# EAGLE design Keypad Arduino Uno Shield (EAGLE 9.6.2)
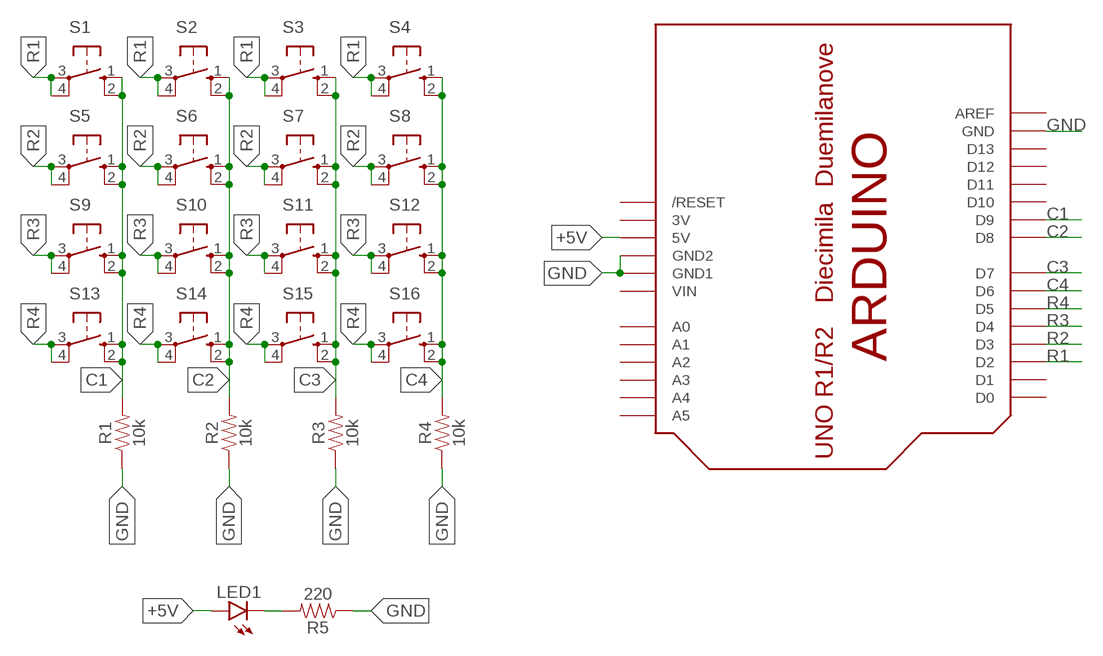
[diagram p0: schematic, sheet 1]

## Parts
LED1  LEDSML0805  [SML0805]
R1  10k  RESISTOR1206  [1206]
R2  10k  RESISTOR1206  [1206]
R3  10k  RESISTOR1206  [1206]
R4  10k  RESISTOR1206  [1206]
R5  220  RESISTOR1206  [1206]
S1  10-XX  [B3F-10XX]
S2  10-XX  [B3F-10XX]
S3  10-XX  [B3F-10XX]
S4  10-XX  [B3F-10XX]
S5  10-XX  [B3F-10XX]
S6  10-XX  [B3F-10XX]
S7  10-XX  [B3F-10XX]
S8  10-XX  [B3F-10XX]
S9  10-XX  [B3F-10XX]
S10  10-XX  [B3F-10XX]
S11  10-XX  [B3F-10XX]
S12  10-XX  [B3F-10XX]
S13  10-XX  [B3F-10XX]
S14  10-XX  [B3F-10XX]
S15  10-XX  [B3F-10XX]
S16  10-XX  [B3F-10XX]
U$1  ARDUINOUNO  [ARDUINO]

## Nets
+5V: LED1.A U$1.5V
C1: R1.2 S1.1(S) S1.2(S1) S5.1(S) S5.2(S1) S9.1(S) S9.2(S1) S13.1(S) S13.2(S1) U$1.D9
C2: R2.2 S2.1(S) S2.2(S1) S6.1(S) S6.2(S1) S10.1(S) S10.2(S1) S14.1(S) S14.2(S1) U$1.D8
C3: R3.2 S3.1(S) S3.2(S1) S7.1(S) S7.2(S1) S11.1(S) S11.2(S1) S15.1(S) S15.2(S1) U$1.D7
C4: R4.2 S4.1(S) S4.2(S1) S8.1(S) S8.2(S1) S12.1(S) S12.2(S1) S16.1(S) S16.2(S1) U$1.D6
GND: R1.1 R2.1 R3.1 R4.1 R5.1 U$1.GND U$1.GND1 U$1.GND2
N$10: LED1.C R5.2
R1: S1.3(P) S1.4(P1) S2.3(P) S2.4(P1) S3.3(P) S3.4(P1) S4.3(P) S4.4(P1) U$1.D2
R2: S5.3(P) S5.4(P1) S6.3(P) S6.4(P1) S7.3(P) S7.4(P1) S8.3(P) S8.4(P1) U$1.D3
R3: S9.3(P) S9.4(P1) S10.3(P) S10.4(P1) S11.3(P) S11.4(P1) S12.3(P) S12.4(P1) U$1.D4
R4: S13.3(P) S13.4(P1) S14.3(P) S14.4(P1) S15.3(P) S15.4(P1) S16.3(P) S16.4(P1) U$1.D5
Unconnected: U$1.A0 U$1.A1 U$1.A2 U$1.A3 U$1.A4 U$1.A5 U$1.AREF U$1.D0 U$1.D1 U$1.D10 U$1.D11 U$1.D12 U$1.D13 U$1.RESET(/RESET)

## Power pins joined to a net without a drawn wire
3V: U$1.3V
VIN: U$1.VIN

## Library data of the parts
LED1 = led:LED: LED OSRAM: - CHIPLED LG R971, LG N971, LY N971, LG Q971, LY Q971, LO R971, LY R971 LH N974, LH R974 LS Q976, LO Q976, LY Q976 LO Q996 - Hyper CHIPLED LW Q18S LB Q993, LB Q99A, LB R99A - SideLED LS A670, LO A670, LY A670, LG A670, LP A670 LB A673, LV A673, LT A673, LW A673 LH A674 LY A675 LS A676, LA A676, LO A676, LY A676, LW A676 LS A679, LY A679, LG A679 - Hyper Micro SIDELED® LS Y876, LA Y876, LO Y876, LY Y876 LT Y87S - SmartLED LW L88C, LW L88S LB L89C, LB L89S, LG L890 LS L89K, LO L89K, LY L89K LS L896, LA L896, LO L896, LY L896 - TOPLED LS T670, LO T670, LY T670, LG T670, LP T670 LSG T670, LSP T670, LSY T670, LOP T670, LYG T670 LG T671, LOG T671, LSG T671 LB T673, LV T673, LT T673, LW T673 LH T674 LS T676, LA T676, LO T676, LY T676, LB T676, LH T676, LSB T676, LW T676 LB T67C, LV T67C, LT T67C, LS T67K, LO T67K, LY T67K, LW E67C LS E67B, LA E67B, LO E67B, LY E67B, LB E67C, LV E67C, LT E67C LW T67C LS T679, LY T679, LG T679 LS T770, LO T770, LY T770, LG T770, LP T770 LB T773, LV T773, LT T773, LW T773 LH T774 LS E675, LA E675, LY E675, LS T675 LS T776, LA T776, LO T776, LY T776, LB T776 LHGB T686 LT T68C, LB T68C - Hyper Mini TOPLED® LB M676 - Mini TOPLED Santana® LG M470 LS M47K, LO M47K, LY M47K Source: http://www.osram.convergy.de LUXEON: - LUMILED® LXK2-PW12-R00, LXK2-PW12-S00, LXK2-PW14-U00, LXK2-PW14-V00 LXK2-PM12-R00, LXK2-PM12-S00, LXK2-PM14-U00 LXK2-PE12-Q00, LXK2-PE12-R00, LXK2-PE12-S00, LXK2-PE14-T00, LXK2-PE14-U00 LXK2-PB12-K00, LXK2-PB12-L00, LXK2-PB12-M00, LXK2-PB14-N00, LXK2-PB14-P00, LXK2-PB14-Q00 LXK2-PR12-L00, LXK2-PR12-M00, LXK2-PR14-Q00, LXK2-PR14-R00 LXK2-PD12-Q00, LXK2-PD12-R00, LXK2-PD12-S00 LXK2-PH12-R00, LXK2-PH12-S00 LXK2-PL12-P00, LXK2-PL12-Q00, LXK2-PL12-R00 Source: www.luxeon.com KINGBRIGHT: KA-3528ASYC Source: www.kingbright.com
R1-R5 = SparkFun-Resistors:RESISTOR: Generic Resistor Package
S1-S16 = switch-omron:10-XX: OMRON SWITCH; MPN: B3F-1000; OC_FARNELL: 176432; OC_NEWARK: 36M3542
U$1 = adafruit:ARDUINO: Arduino Diecimila/Duemilanove Make a shield with ease, this package has all the named pins as well as the two mounting drill holes and an outline of the USB and DC power connector. The outline is on the DIMENSION layer, so if your board house uses it they will cut the outline to match. http://www.ladyada.net/library/pcb/eaglelibrary.html

## Board
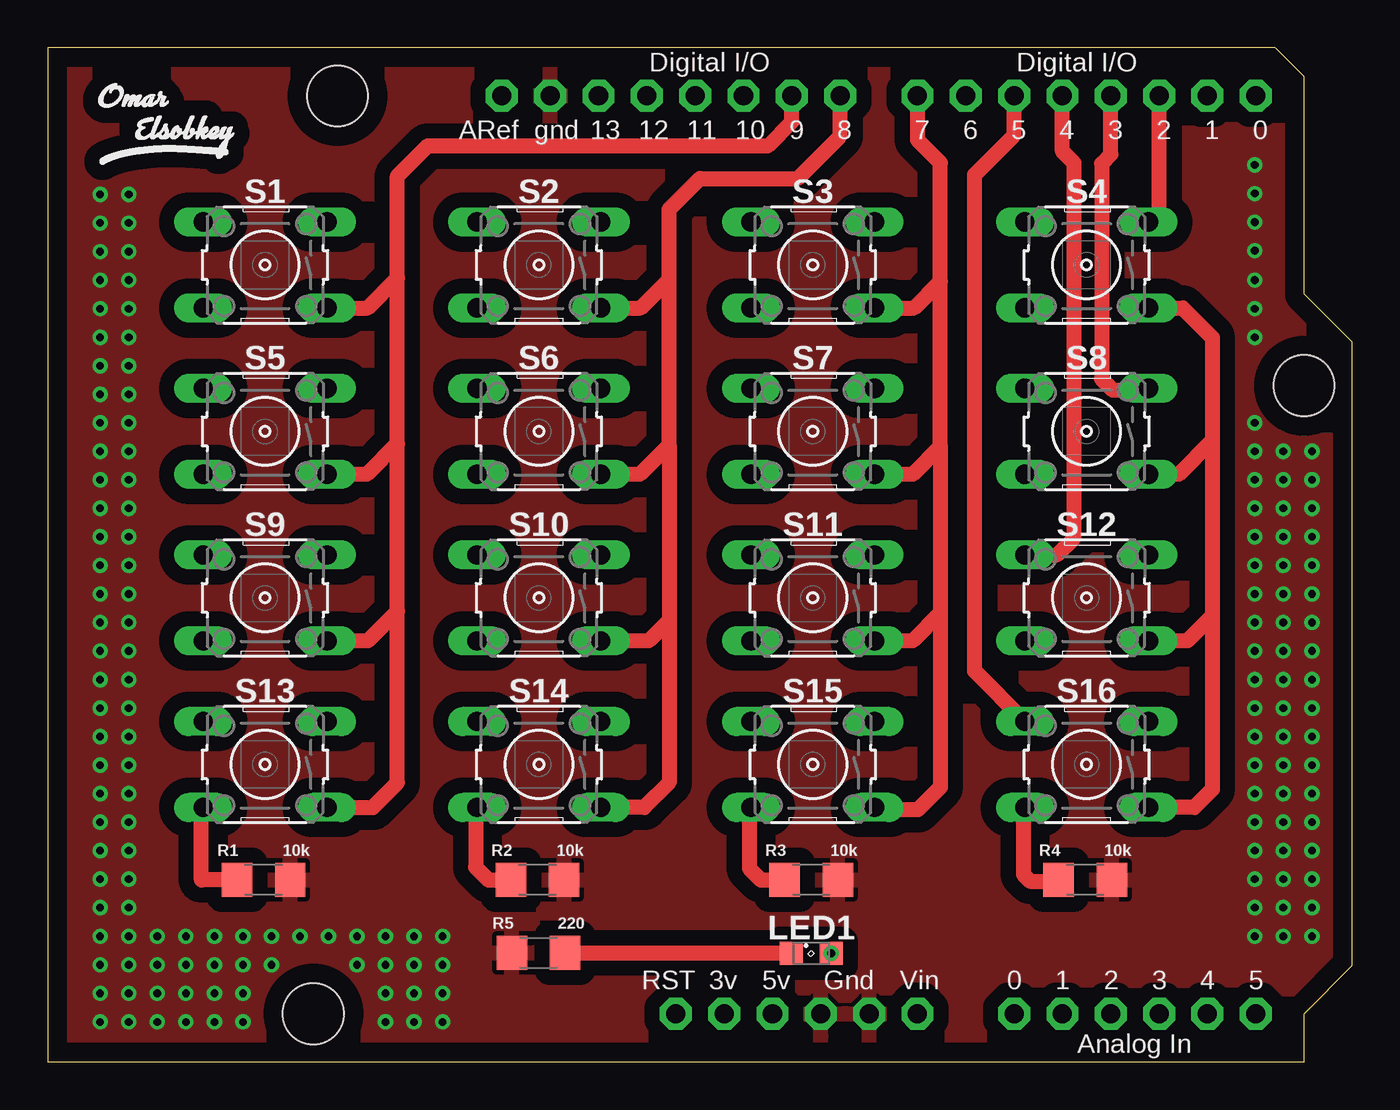
[diagram p1: board, top side]
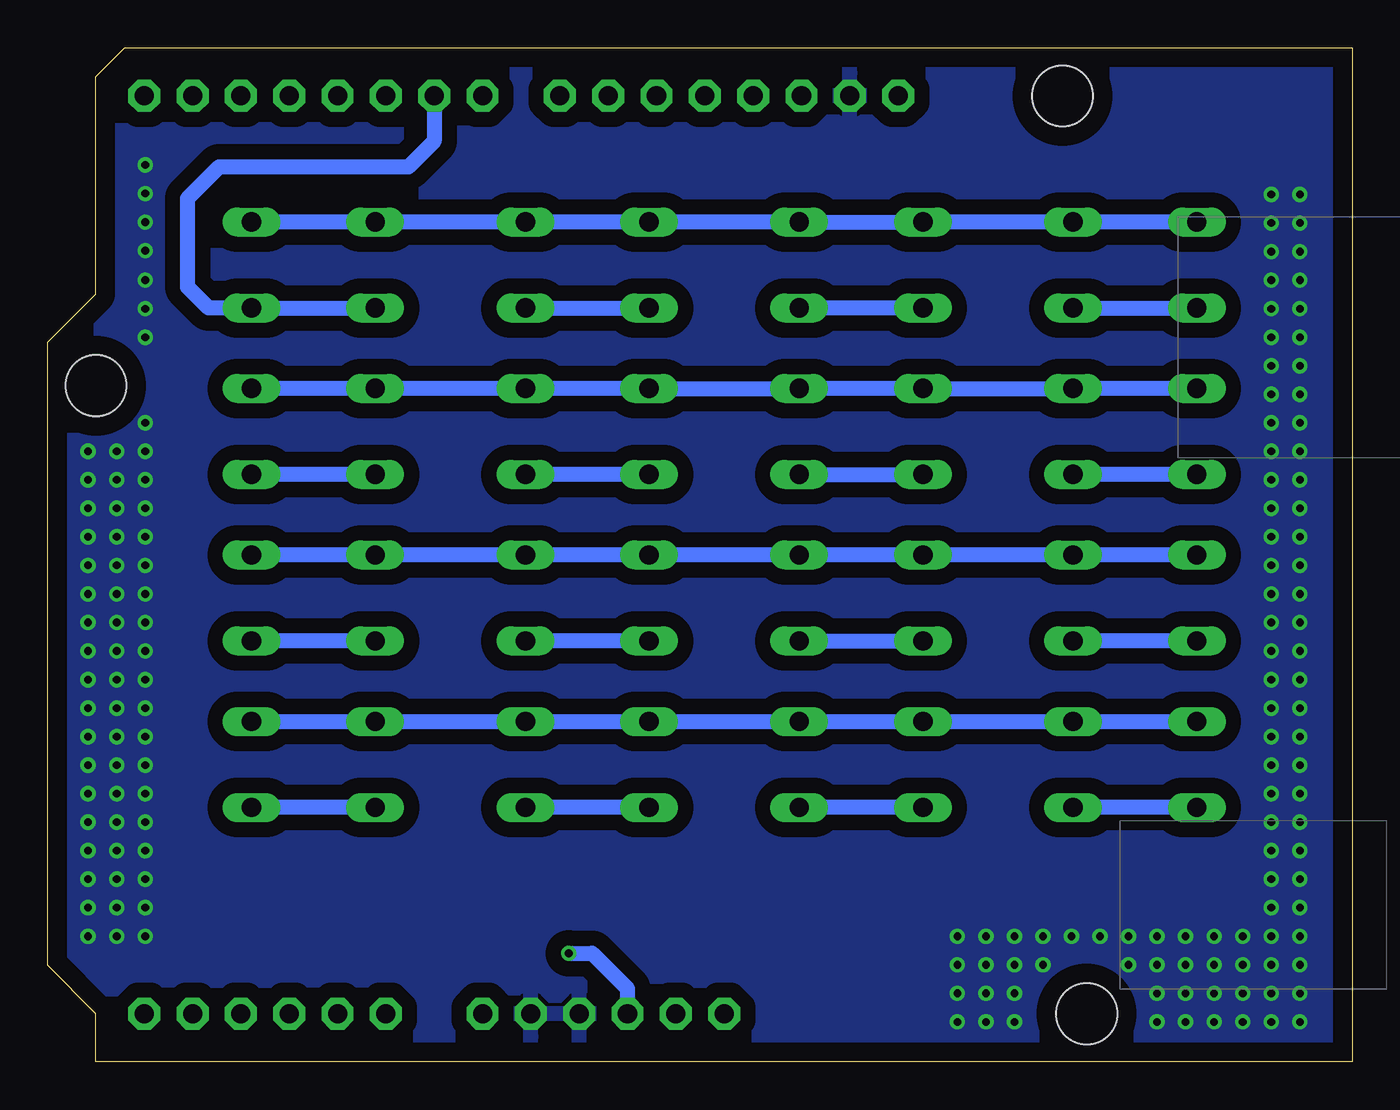
[diagram p2: board, bottom side, seen from below]

Size 68.58 x 53.34 mm. Coordinates in mm from the lower left corner, seen from the top.
Copper layers (1*16): Top 0.035mm / dielectric 1.5mm / Bottom 0.035mm
Design rules "default *": minimum track width 0.6mm, minimum drill 0.4mm, track to track 0.4mm, track to pad 0.4mm, pad to pad 0.4mm, via to via 0.4mm, smd to smd 0.4mm, copper to edge 40mil, drill to drill 6mil, minimum pad ring 10mil, minimum via ring 8mil, stop-mask expansion 4mil, vias tented up to drill 0mil, thermal gap 10mil

### Footprints (pad centres in the part's own frame; a part is rotated, then mirrored left to right if it is on the bottom)
SML0805 = smd 1.2 x 1.2: A 1.05,0; C -1.05,0
1206 = smd 1.6 x 1.8: 1 -1.4,0; 2 1.4,0
B3F-10XX = drill 1.016 long: 1 -3.251,2.261; 2 3.251,2.261; 3 -3.251,-2.261; 4 3.251,-2.261
ARDUINO = drill 1 pad 1.676 octagon: 3V 35.56,2.54; 5V 38.1,2.54; A0 50.8,2.54; A1 53.34,2.54; A2 55.88,2.54; A3 58.42,2.54; A4 60.96,2.54; A5 63.5,2.54; AREF 23.876,50.8; D0 63.5,50.8; D1 60.96,50.8; D2 58.42,50.8; D3 55.88,50.8; D4 53.34,50.8; D5 50.8,50.8; D6 48.26,50.8; D7 45.72,50.8; D8 41.656,50.8; D9 39.116,50.8; D10 36.576,50.8; D11 34.036,50.8; D12 31.496,50.8; D13 28.956,50.8; GND 26.416,50.8; GND1 43.18,2.54; GND2 40.64,2.54; RESET 33.02,2.54; VIN 45.72,2.54 | hole 3.2: 15.24,50.8; 66.04,35.56; 13.97,2.54

### Placement (x,y rotation side)
LED1  40.14,5.72 0 top
R1  11.35,9.58 180 top
R2  25.75,9.58 180 top
R3  40.14,9.58 180 top
R4  54.53,9.58 180 top
R5  25.81,5.75 0 top
S1  11.43,41.91 180 top
S2  25.82,41.91 180 top
S3  40.22,41.91 180 top
S4  54.61,41.91 180 top
S5  11.43,33.16 180 top
S6  25.82,33.16 180 top
S7  40.22,33.16 180 top
S8  54.61,33.16 180 top
S9  11.43,24.4 180 top
S10  25.82,24.4 180 top
S11  40.22,24.4 180 top
S12  54.61,24.4 180 top
S13  11.43,15.65 180 top
S14  25.82,15.65 180 top
S15  40.22,15.65 180 top
S16  54.61,15.65 180 top
U$1  0,0 0 top
U$2  [OMAR_ELSOBKEY_X0.5]  5.89,49.12 0 top

### Tracks (layer width: path | path; a pad name or v marks a point on that pad's centre or on a via)
+5V  (via drill 0.4)
  Top 0.8: LED1.A 41.19,5.63
  Bottom 0.8: U$1.5V 38.1,3.86 39.95,5.72 LED1.A
  other vias: 41.19,5.72
C1
  Top 0.8: S13.1 17.09,13.38 18.39,14.68 18.39,23.7 | S1.1 16.82,39.65 18.39,41.22 | 18.39,23.7 18.39,32.51 | 18.39,32.51 18.39,41.22 | 18.39,23.7 16.83,22.14 S9.1 | 18.39,32.51 16.77,30.89 S5.1 | R1.2 8.08,9.58 8.08,13.28 S13.2 | 18.39,41.22 18.39,46.58 19.96,48.16 37.85,48.16 39.12,49.43 U$1.D9
  Bottom 0.8: S1.1 S1.2 | S5.2 S5.1 | S9.2 S9.1 | S13.2 S13.1
C2
  Top 0.8: S14.1 31.37,13.38 32.66,14.68 32.66,23.22 | 32.66,32.44 32.66,41.15 | 32.66,32.44 32.66,23.22 | 32.66,32.44 31.12,30.89 S6.1 | 32.66,23.22 31.59,22.14 S10.1 | S14.2 22.5,13.31 22.5,10.24 23.16,9.58 R2.2 | 32.66,41.15 32.66,44.83 34.29,46.46 39.42,46.46 41.66,48.69 U$1.D8 | S2.1 31.17,39.65 32.66,41.15
  Bottom 0.8: S2.2 S2.1 | S6.1 S6.2 | S14.2 S14.1 | S10.1 S10.2
C3
  Top 0.8: S3.1 45.54,39.65 46.93,41.03 | 46.93,32.36 46.93,41.03 | 46.93,32.36 46.93,23.6 | 46.93,23.6 46.93,14.44 45.74,13.26 43.59,13.26 S15.1 | 46.93,32.36 45.46,30.89 S7.1 | 46.93,23.6 45.47,22.14 S11.1 | S15.2 36.89,13.31 36.89,10.18 37.49,9.58 R3.2 | 46.93,41.03 46.93,47.28 45.72,48.49 U$1.D7
  Bottom 0.8: S3.1 S3.2 | S7.2 S7.1 | S15.2 S15.1 | S11.2 S11.1
C4
  Top 0.8: S4.1 59.66,39.65 61.21,38.1 61.21,32.66 | S16.1 60.27,13.38 61.21,14.33 61.21,23.44 | 61.21,32.66 61.21,23.44 | 61.21,23.44 59.91,22.14 S12.1 | 61.21,32.66 59.44,30.89 S8.1 | S16.2 51.28,13.31 51.28,9.86 51.64,9.5 53.06,9.5 R4.2
  Bottom 0.8: S4.2 S4.1 60.12,39.65 61.21,40.74 61.21,45.41 59.56,47.07 49.61,47.07 48.26,48.41 U$1.D6 | S8.2 S8.1 | S12.2 S12.1 | S16.2 S16.1
GND  (via drill 0.4)
  other vias: 63.45,6.61 4.27,2.11 2.77,2.11 4.27,3.61 2.77,3.61 4.27,5.11 2.77,5.11 4.27,6.61 2.77,6.61 4.27,8.11 2.77,8.11 4.27,9.61 2.77,9.61 4.27,11.11 2.77,11.11 4.27,12.61 2.77,12.61 4.27,14.11 2.77,14.11 2.77,15.61 2.77,17.11 2.77,18.61 2.77,20.11 2.77,21.61 2.77,23.11 2.77,24.61 2.77,26.11 2.77,27.61 2.77,29.11 2.77,30.61 2.77,32.11 2.77,33.61 2.77,35.11 2.77,36.61 2.77,38.11 2.77,39.61 2.77,41.11 2.77,42.61 2.77,44.11 2.77,45.61 4.27,15.61 4.27,17.11 4.27,18.61 4.27,20.11 4.27,21.61 4.27,23.11 4.27,24.61 4.27,26.11 4.27,27.61 4.27,29.11 4.27,30.61 4.27,32.11 4.27,33.61 4.27,35.11 4.27,36.61 4.27,38.11 4.27,39.61 4.27,41.11 4.27,42.61 4.27,44.11 4.27,45.61 5.77,6.61 7.27,6.61 8.77,6.61 10.27,6.61 11.77,6.61 13.27,6.61 14.77,6.61 16.27,6.61 17.77,6.61 19.27,6.61 20.77,6.61 5.77,5.11 7.27,5.11 8.77,5.11 10.27,5.11 11.77,5.11 16.27,5.11 17.77,5.11 19.27,5.11 20.77,5.11 5.77,2.11 7.27,2.11 8.77,2.11 10.27,2.11 17.77,2.11 19.27,2.11 20.77,2.11 5.77,3.61 7.27,3.61 8.77,3.61 10.27,3.61 17.77,3.61 19.27,3.61 20.77,3.61 63.45,8.11 63.45,9.61 63.45,11.11 63.45,12.61 63.45,14.11 63.45,15.61 63.45,17.11 63.45,18.61 63.45,20.11 63.45,21.61 63.45,23.11 63.45,24.61 63.45,26.11 63.45,27.61 63.45,29.11 63.45,30.61 63.45,32.11 63.45,33.61 63.45,38.11 63.45,39.61 63.45,41.11 63.45,42.66 63.45,44.16 63.45,45.66 63.45,47.16 64.95,6.61 66.45,6.61 64.95,8.11 64.95,9.61 64.95,11.11 64.95,12.61 64.95,14.11 64.95,15.61 64.95,17.11 64.95,18.61 64.95,20.11 64.95,21.61 64.95,23.11 64.95,24.61 64.95,26.11 64.95,27.61 64.95,29.11 64.95,30.61 64.95,32.11 66.45,8.11 66.45,9.61 66.45,11.11 66.45,12.61 66.45,14.11 66.45,15.61 66.45,17.11 66.45,18.61 66.45,20.11 66.45,21.61 66.45,23.11 66.45,24.61 66.45,26.11 66.45,27.61 66.45,29.11 66.45,30.61 66.45,32.11
  pour Bottom (isolate 0.8): -1.07,54.25 72.59,54.25 72.59,-1.27 -1.07,-1.27
  pour Top (isolate 0.8): -3.66,56.13 75.03,56.13 75.03,-3.1 -3.66,-3.1
N$10
  Top 0.8: R5.2 39.06,5.75 LED1.C
R1
  Top 0.8: S4.3 58.42,44.73 U$1.D2
  Bottom 0.8: S1.4 S1.3 S2.4 S2.3 S3.4 S3.3 S4.4 | S4.4 | S4.4 S4.3
R2
  Top 0.8: U$1.D3 55.88,47.73 55.4,47.24 55.4,35.92 56.01,35.31 57.75,35.31 S8.3
  Bottom 0.8: S5.4 S5.3 S6.4 S6.3 S7.4 S7.3 S8.4 | S8.4 | S8.4 S8.3
R3
  Top 0.8: S12.4 53.05,26.66 53.95,27.56 53.95,47.27 53.34,47.88 U$1.D4
  Bottom 0.8: S9.4 S9.3 S10.4 S10.3 S11.4 S11.3 S12.4 S12.3
R4
  Top 0.8: S16.4 48.72,20.55 48.72,46.66 50.8,48.74 U$1.D5
  Bottom 0.8: S16.3 S16.4 S15.3 S15.4 S14.3 S14.4 S13.3 S13.4